# Altium schematic sheet DRLPWM.SchDoc
size A4
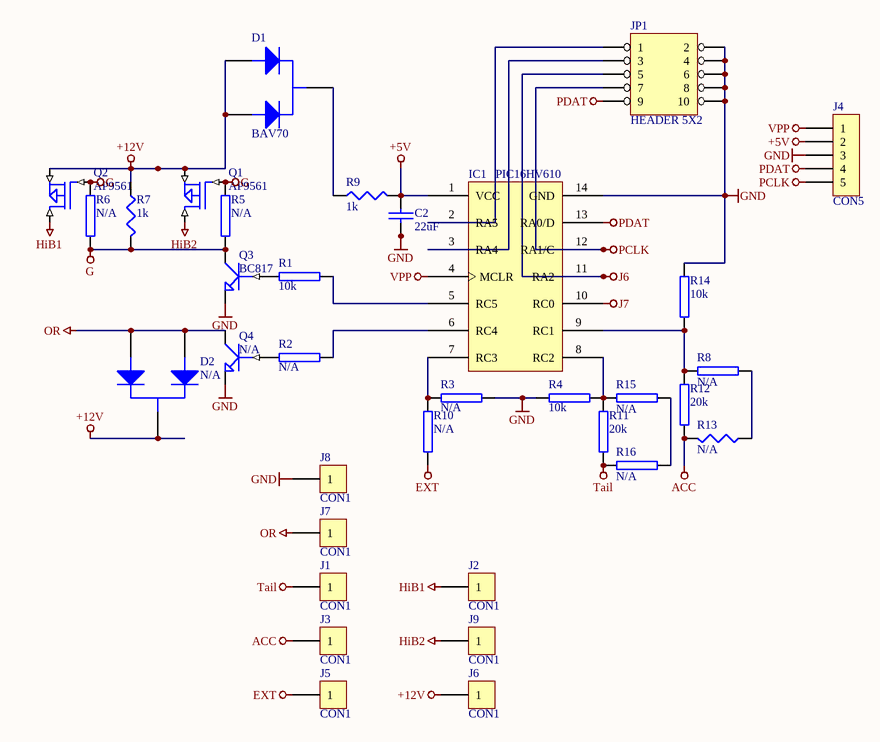
[diagram p0: DRLPWM.SchDoc]

## Parts
C2  22uF  [0805]
D1  BAV70  [SOT-23]
D2  N/A  [SOT-23]
IC1  PIC16HV610  [SO-14]
J1  CON1  [SIP1 - WIRE]
J2  CON1  [SIP1 - WIRE]
J3  CON1  [SIP1 - WIRE]
J4  CON5  [SIP5 - PGM]
J5  CON1  [SIP1 - WIRE]
J6  CON1  [SIP1 - WIRE]
J7  CON1  [SIP1 - WIRE]
J8  CON1  [SIP1 - WIRE]
J9  CON1  [SIP1 - WIRE]
JP1  HEADER 5X2  [IDC10]
Q1  AP9561  [D-Pack]
Q2  AP9561  [D-Pack]
Q3  BC817  [SOT-23]
Q4  N/A  [SOT-23]
R1  10k  [0805]
R2  N/A  [0805]
R3  N/A  [0805]
R4  10k  [0805]
R5  N/A  [0805]
R6  N/A  [0805]
R7  1k  [1206]
R8  N/A  [0805]
R9  1k  [1206]
R10  N/A  [0805]
R11  20k  [0805]
R12  20k  [0805]
R13  N/A  [0805]
R14  10k  [0805]
R15  N/A  [0805]
R16  N/A  [0805]

## Nets
+5V: C2.1 IC1.1(VCC) J4.2 R9.2
+12V: D1.1(A1) D1.3(A2) D2.2(K) J6.1 Q1.3(SOURCE) Q2.3(SOURCE) R7.1
ACC: J3.1 R12.1 R13.2
EXT: J5.1 R10.1
G: Q1.1(GATE) Q2.1(GATE) Q3.2(C) R5.1 R5.2 R6.1 R6.2 R7.2
GND: C2.2 IC1.14(GND) J4.3 J8.1 JP1.2 JP1.4 JP1.6 JP1.8 JP1.10 Q3.3(E) Q4.3(E) R3.2 R4.1 R14.2
HiB1: J2.1 Q2.2(DRAIN)
HiB2: J9.1 Q1.2(DRAIN)
J6: IC1.11(RA2) JP1.5
J7: IC1.10(RC0)
OR: D2.1(A1) D2.3(A2) J7.1 Q4.2(C)
PCLK: IC1.12(RA1/C) J4.5 JP1.7
PDAT: IC1.13(RA0/D) J4.4 JP1.9
Tail: J1.1 R11.1 R16.1
VPP: IC1.4(MCLR) J4.1
NetD1_2: D1.2(K) R9.1
NetIC1_2: IC1.2(RA5) JP1.1
NetIC1_3: IC1.3(RA4) JP1.3
NetIC1_5: IC1.5(RC5) R1.2
NetIC1_6: IC1.6(RC4) R2.2
NetIC1_7: IC1.7(RC3) R3.1 R10.2
NetIC1_8: IC1.8(RC2) R4.2 R11.2 R15.1
NetIC1_9: IC1.9(RC1) R8.1 R12.2 R14.1
NetQ3_1: Q3.1(B) R1.1
NetQ4_1: Q4.1(B) R2.1
NetR8_2: R8.2 R13.1
NetR15_2: R15.2 R16.2

## Library data of the parts
C2 = CAP
D1 D2 = DUAL DIODE BAV70
J1-J3 J5-J9 = CON1: Connector
J4 = CON5: Connector
Q1 Q2 = MOSFET P
Q3 Q4 = NPN1: NPN Transistor
R1-R6 R8 R10-R12 R14-R16 = RES2
R7 R9 R13 = RES1